# EAGLE design placa 2 (EAGLE 9.3.0)
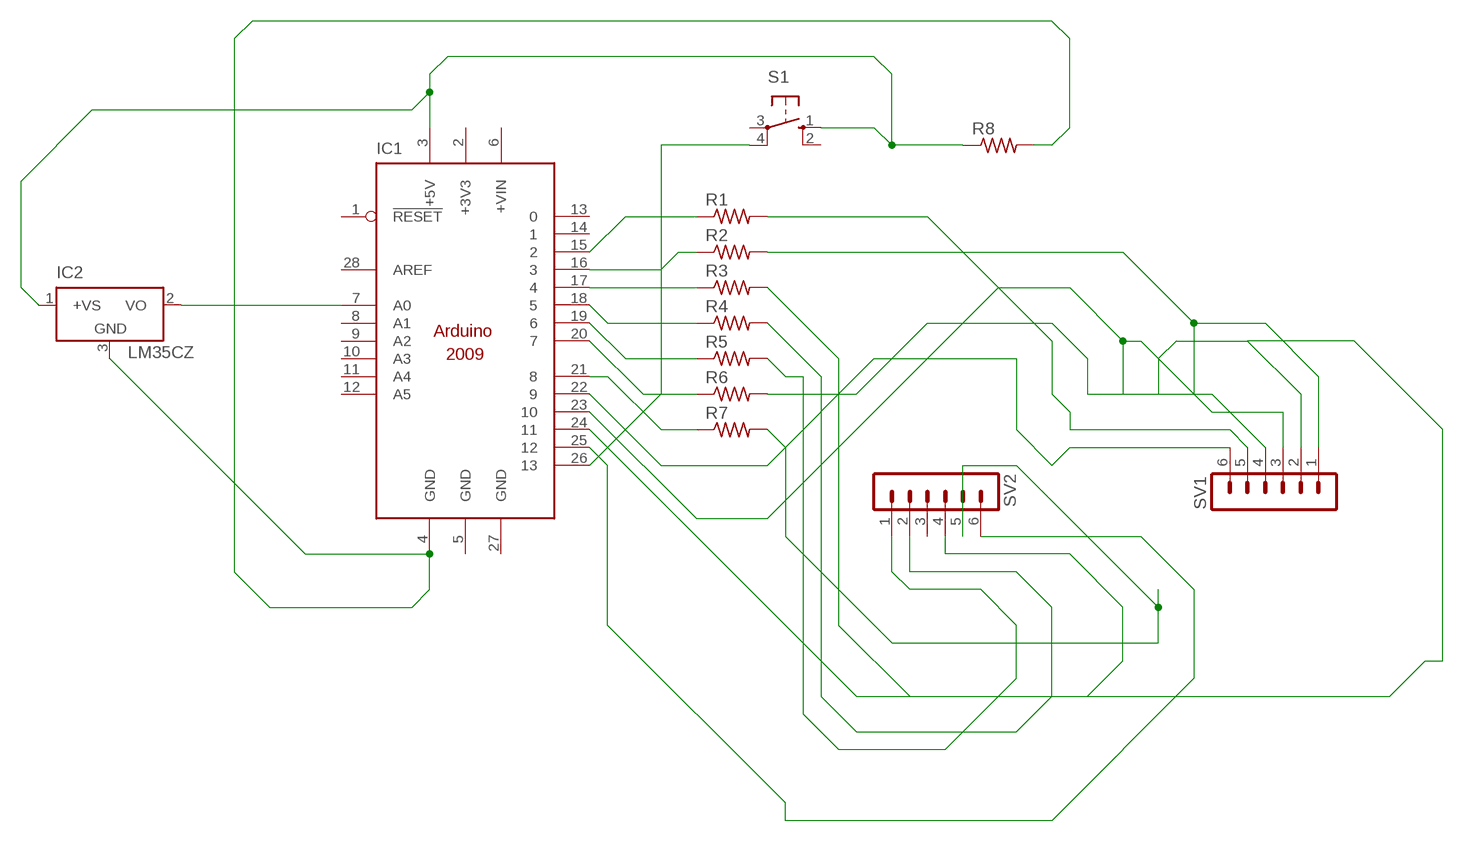
[diagram p0: schematic, sheet 1]

## Parts
IC1  ARDUINO2009_11  [ARDUINO2009_1]
IC2  LM35CZ  [TO92]
R1  R-US_0207/15  [0207/15]
R2  R-US_0207/15  [0207/15]
R3  R-US_0207/15  [0207/15]
R4  R-US_0207/15  [0207/15]
R5  R-US_0207/15  [0207/15]
R6  R-US_0207/15  [0207/15]
R7  R-US_0207/15  [0207/15]
R8  R-US_0207/15  [0207/15]
S1  10-XX  [B3F-10XX]
SV1  MA06-1  [MA06-1]
SV2  MA06-1  [MA06-1]

## Nets
N$1: IC1.21 R7.1
N$2: IC1.20 R6.1
N$3: IC1.19 R5.1
N$4: IC1.18 R4.1
N$5: IC1.17 R3.1
N$6: IC1.16 R2.1
N$7: IC1.15 R1.1
N$8: R1.2 SV1.5
N$9: R2.2 SV1.1
N$10: R3.2 SV2.4
N$11: R4.2 SV2.2
N$12: R5.2 SV2.1
N$13: R6.2 SV1.4
N$14: R7.2 SV2.5
N$15: IC1.22 SV1.6
N$16: IC1.23 SV1.3
N$17: IC1.24 SV1.2
N$18: IC1.25 SV2.6
N$19: IC1.3(+5V) IC2.1(+VS) R8.1 S1.1(S)
N$20: IC1.26 S1.4(P1)
N$21: IC1.4(GND) IC2.3(GND) R8.2
N$22: IC1.7(A0) IC2.2(VO)
Unconnected: IC1.1(!RESET) IC1.6(+VIN) IC1.8(A1) IC1.9(A2) IC1.10(A3) IC1.11(A4) IC1.12(A5) IC1.13 IC1.14 IC1.28(AREF) S1.2(S1) S1.3(P) SV2.3

## Power pins joined to a net without a drawn wire
+3V3: IC1.2(+3V3)
GND: IC1.5(GND) IC1.27(GND)

## Library data of the parts
IC1 = arduino:ARDUINO2009_1: The Arduino Duemilanove ("2009") is a microcontroller board based on the ATmega168 or ATmega328. - 14 digital input/output pins (of which 6 can be used as PWM outputs) - 6 analog inputs, a 16 MHz crystal oscillator - USB connection - power jack - ISP header - reset button It contains everything needed to support the microcontroller; simply connect it to a computer with a USB cable or power it with a AC-to-DC adapter or battery to get started http://arduino.cc/en/Main/ArduinoBoardDuemilanove
IC2 = lm35:LM35: Single-Supply Centigrade Temperature Sensor Vout = (10mV/°C x Temp °C) +5mmmV Source: http://www.national.com/ds/LM/LM35.pdf
R1-R8 = rcl:R-US_: RESISTOR, American symbol; SPICEPREFIX: R
S1 = switch-omron:10-XX: OMRON SWITCH; MPN: B3F-1000; OC_FARNELL: 176432; OC_NEWARK: 36M3542
SV1 SV2 = con-lstb:MA06-1: PIN HEADER; OC_FARNELL: unknown; OC_NEWARK: unknown

## Board
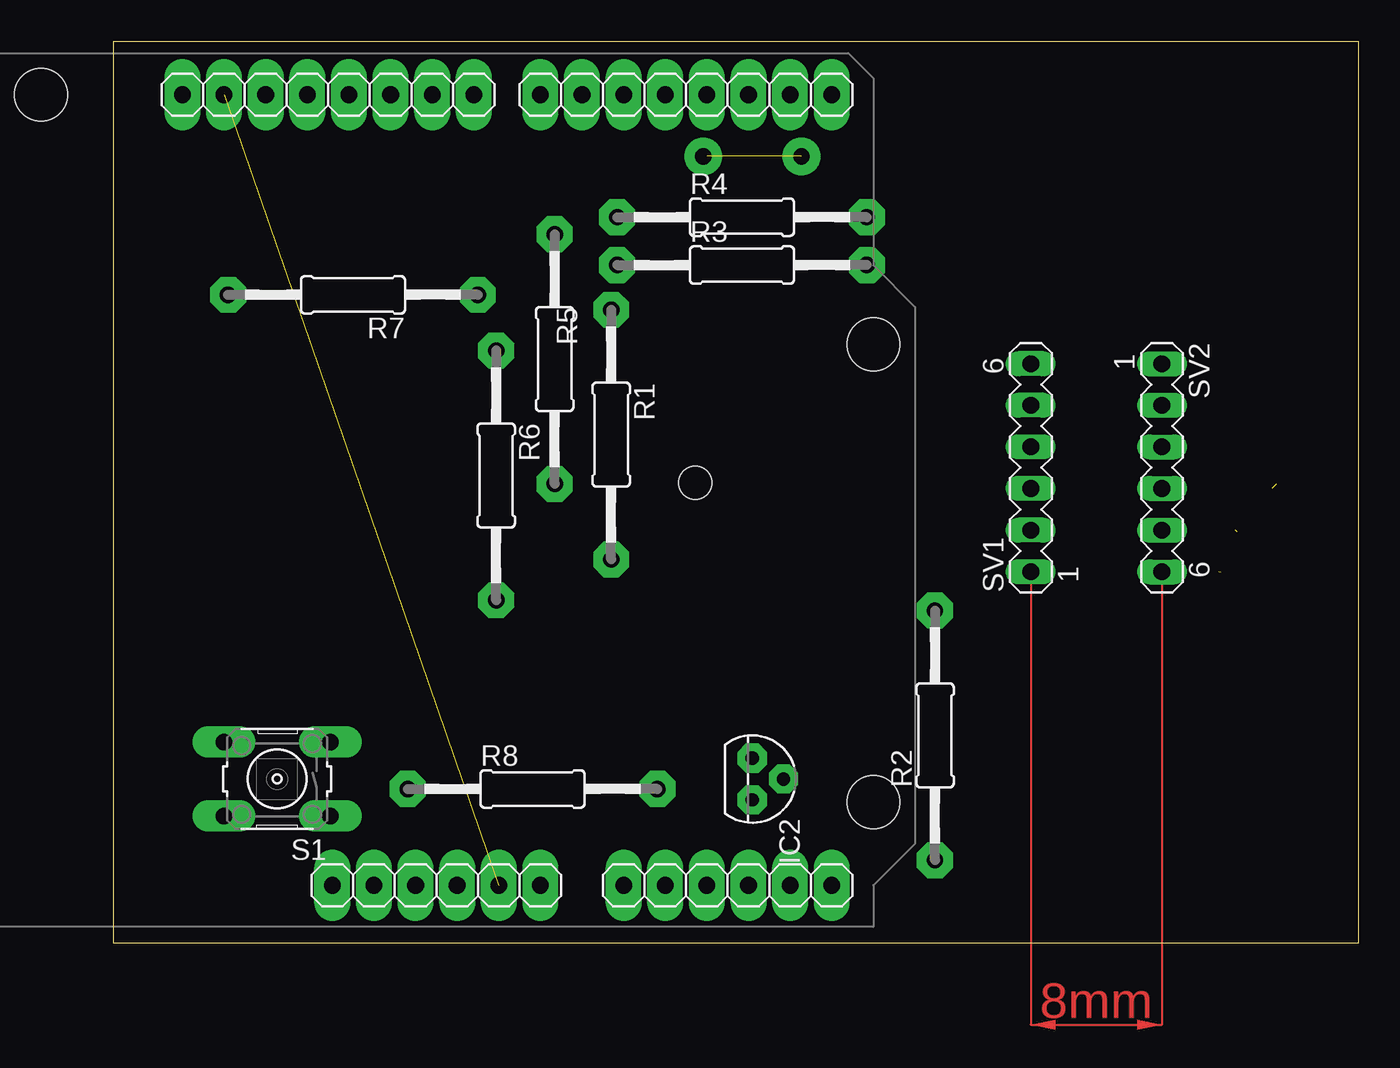
[diagram p1: board, top side]
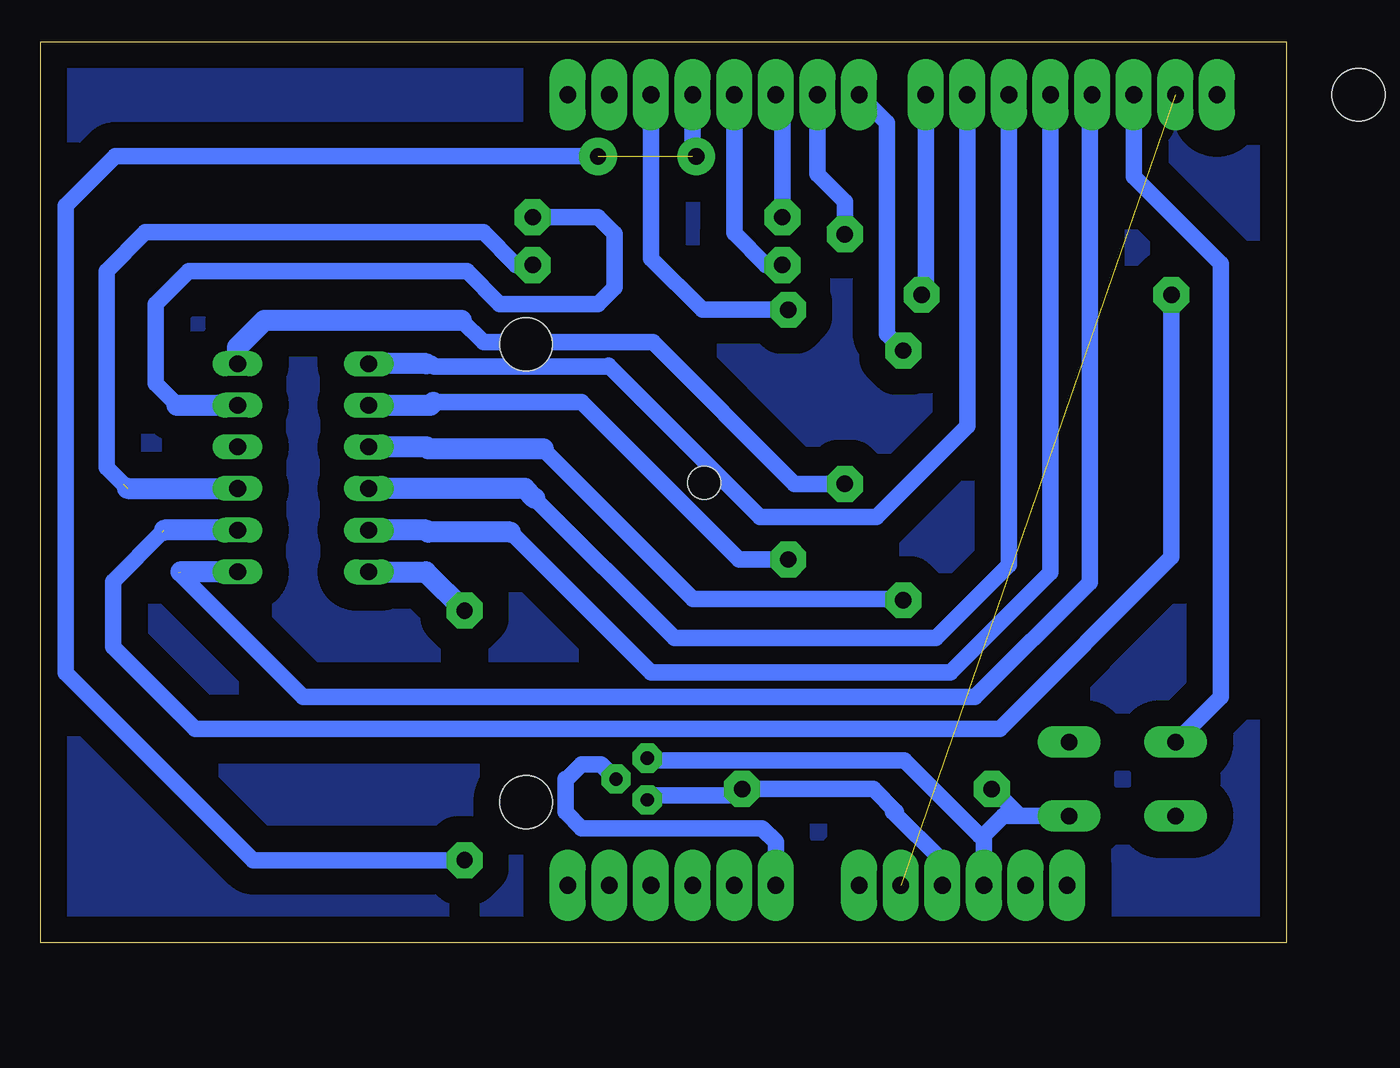
[diagram p2: board, bottom side, seen from below]

Size 76 x 55 mm. Coordinates in mm from the lower left corner, seen from the top.
Outline: 0,0 76,0 76,55 0,55 0,0
Copper layers (1*16): Top 0.035mm / dielectric 1.5mm / Bottom 0.035mm
Design rules "default": minimum track width 6mil, minimum drill 0.35mm, track to track 6mil, track to pad 6mil, pad to pad 6mil, via to via 6mil, smd to smd 6mil, copper to edge 40mil, drill to drill 6mil, minimum pad ring 10mil, minimum via ring 8mil, stop-mask expansion 4mil, vias tented up to drill 0mil, thermal gap 10mil

### Footprints (pad centres in the part's own frame; a part is rotated, then mirrored left to right if it is on the bottom)
ARDUINO2009_1 = drill 1.016 pad 2.184 long: 1 33.02,2.54; 2 35.56,2.54; 3 38.1,2.54; 4 40.64,2.54; 5 43.18,2.54; 6 45.72,2.54; 7 50.8,2.54; 8 53.34,2.54; 9 55.88,2.54; 10 58.42,2.54; 11 60.96,2.54; 12 63.5,2.54; 13 63.5,50.8; 14 60.96,50.8; 15 58.42,50.8; 16 55.88,50.8; 17 53.34,50.8; 18 50.8,50.8; 19 48.26,50.8; 20 45.72,50.8; 21 41.656,50.8; 22 39.116,50.8; 23 36.576,50.8; 24 34.036,50.8; 25 31.496,50.8; 26 28.956,50.8; 27 26.416,50.8; 28 23.876,50.8 | hole 3.2: 15.24,50.8; 66.04,35.56; 66.04,7.62 | hole 2: 55.17,27.114
TO92 = drill 0.813 pad 1.778 octagon: 1 -1.27,0; 2 0,1.905; 3 1.27,0
0207/15 = drill 1 pad 2.184 octagon: 1 -7.62,0; 2 7.62,0
B3F-10XX = drill 1 pad 1.93 long: 1 -3.251,2.261; 2 3.251,2.261; 3 -3.251,-2.261; 4 3.251,-2.261
MA06-1 = drill 1.016 long: 1 -6.35,0; 2 -3.81,0; 3 -1.27,0; 4 1.27,0; 5 3.81,0; 6 6.35,0

### Placement (x,y rotation side)
IC1  -19.65,0.97 0 top
IC2  39,10 270 top
R1  30.39,31.02 270 top
R2  50.15,12.66 90 top
R3  38.37,41.37 0 top
R4  38.37,44.29 0 top
R5  26.94,35.63 270 top
R6  23.37,28.53 270 top
R7  14.63,39.55 180 top
R8  25.59,9.39 0 top
S1  10,10 180 top
SV1  56,29 90 top
SV2  64,29 270 top

### Tracks (layer width: path | path; a pad name or v marks a point on that pad's centre or on a via)
GND  (1 unrouted)
  pour Bottom (isolate 1.6): 0,55 0,0 77,0 77,55
N$1
  Bottom 1.016: R7.1 22.01,39.79 IC1.21
N$2
  Bottom 1.016: R6.1 24.37,37.15 24.37,50.07 IC1.20
N$3
  Bottom 1.016: IC1.19 28.61,46.92 26.94,45.25 R5.1 26.61,43.58
N$4
  Bottom 1.016: R4.1 30.75,51.37 IC1.18
N$5
  Bottom 1.016: IC1.17 33.69,43.31 31.75,41.37 R3.1
N$6  (via drill 1 pad 2.3)  (1 unrouted)
  Bottom 1.016: R2.1 63.04,5.04 74.48,16.48 74.48,45 71.48,48 v42,48 | IC1.16 36.23,48 36,48
N$7
  Bottom 1.016: IC1.15 38.77,41.77 35.64,38.64 R1.1
N$8
  Bottom 1.016: R1.2 33.4,23.4 43,33 52.04,33
  Bottom 1.27: SV1.5 52.23,32.81 52.04,33
N$9
  Bottom 1.27: R2.2 52.52,22.65 SV1.1
N$10  (1 unrouted)
  Bottom 1.016: 70.59,27.61 70.71,27.73 | 70.99,28.01 72,29.02 72,41 69.63,43.37 48.99,43.37 46.99,41.37 R3.2
  Bottom 1.27: 70.71,27.73 SV2.4
N$11
  Bottom 1.016: R4.2 42,44.29 41,43.29 41,40 42,39 48,39 50,41 67,41 69,39 69,34.12 67.69,32.81
  Bottom 1.27: 67.69,32.81 SV2.2
N$12
  Bottom 1.016: R5.2 30.01,28.01 38.65,36.65 49,36.65 50.35,38
  Bottom 1.27: SV2.1 64,36.35 62.35,38 50.35,38
N$13
  Bottom 1.016: 45.35,30.15 36.2,21 23.46,21 R6.2
  Bottom 1.27: SV1.4 52.47,30.27 52.35,30.15 45.35,30.15
N$14  (1 unrouted)
  Bottom 1.016: 68.59,25.07 71.59,22.07 71.59,18.07 66.59,13.07 17.49,13.07 7.01,23.55 R7.2
  Bottom 1.27: SV2.5 68.47,25.19
N$15
  Bottom 1.016: IC1.22 19.47,31.53 25,26 32.12,26 41.35,35.23 41.41,35.17 52,35.17 52.18,35.35 52.47,35.35
  Bottom 1.27: 52.47,35.35 SV1.6
N$16
  Bottom 1.016: IC1.23 16.93,23.07 21.39,18.61 37.35,18.61 45.87,27.13
  Bottom 1.27: 45.87,27.13 46.47,27.73 SV1.3
N$17
  Bottom 1.016: IC1.24 14.39,22.61 20.5,16.5 38.78,16.5 47.35,25.07
  Bottom 1.27: SV1.2 52.47,25.19 52.35,25.07 47.35,25.07
N$18  (1 unrouted)
  Bottom 1.016: IC1.25 12,51.62 12,22 19,15 60,15 67.59,22.59
  Bottom 1.27: SV2.6 67.47,22.65
N$19
  Bottom 1.016: R8.1 17.9,9.39 16.25,7.74 | S1.1 16.25,7.74 | 16.25,7.74 17.26,7.74 18.45,6.55 | 18.45,6.55 IC1.3 | IC2.1 38.87,11.14 23.31,11.14 18.72,6.55 18.45,6.55
N$20
  Bottom 1.016: IC1.26 9.31,46.77 4,41.46 4,15 7,12 7.01,12 S1.4
N$21
  Bottom 1.016: IC1.4 20.99,4.99 24,8 23.82,8 25.21,9.39 R8.2 33.6,9 38.73,9 IC2.3
N$22
  Bottom 1.016: IC1.7 31.15,6.15 32,7 43,7 44,8 44,10 43.9,10 43,10.9 41.81,10.9 IC2.2
N$23  (via drill 1 pad 2.3)
  other vias: 36,48
(copper drawn outside any net)
  shapes: Top area x1